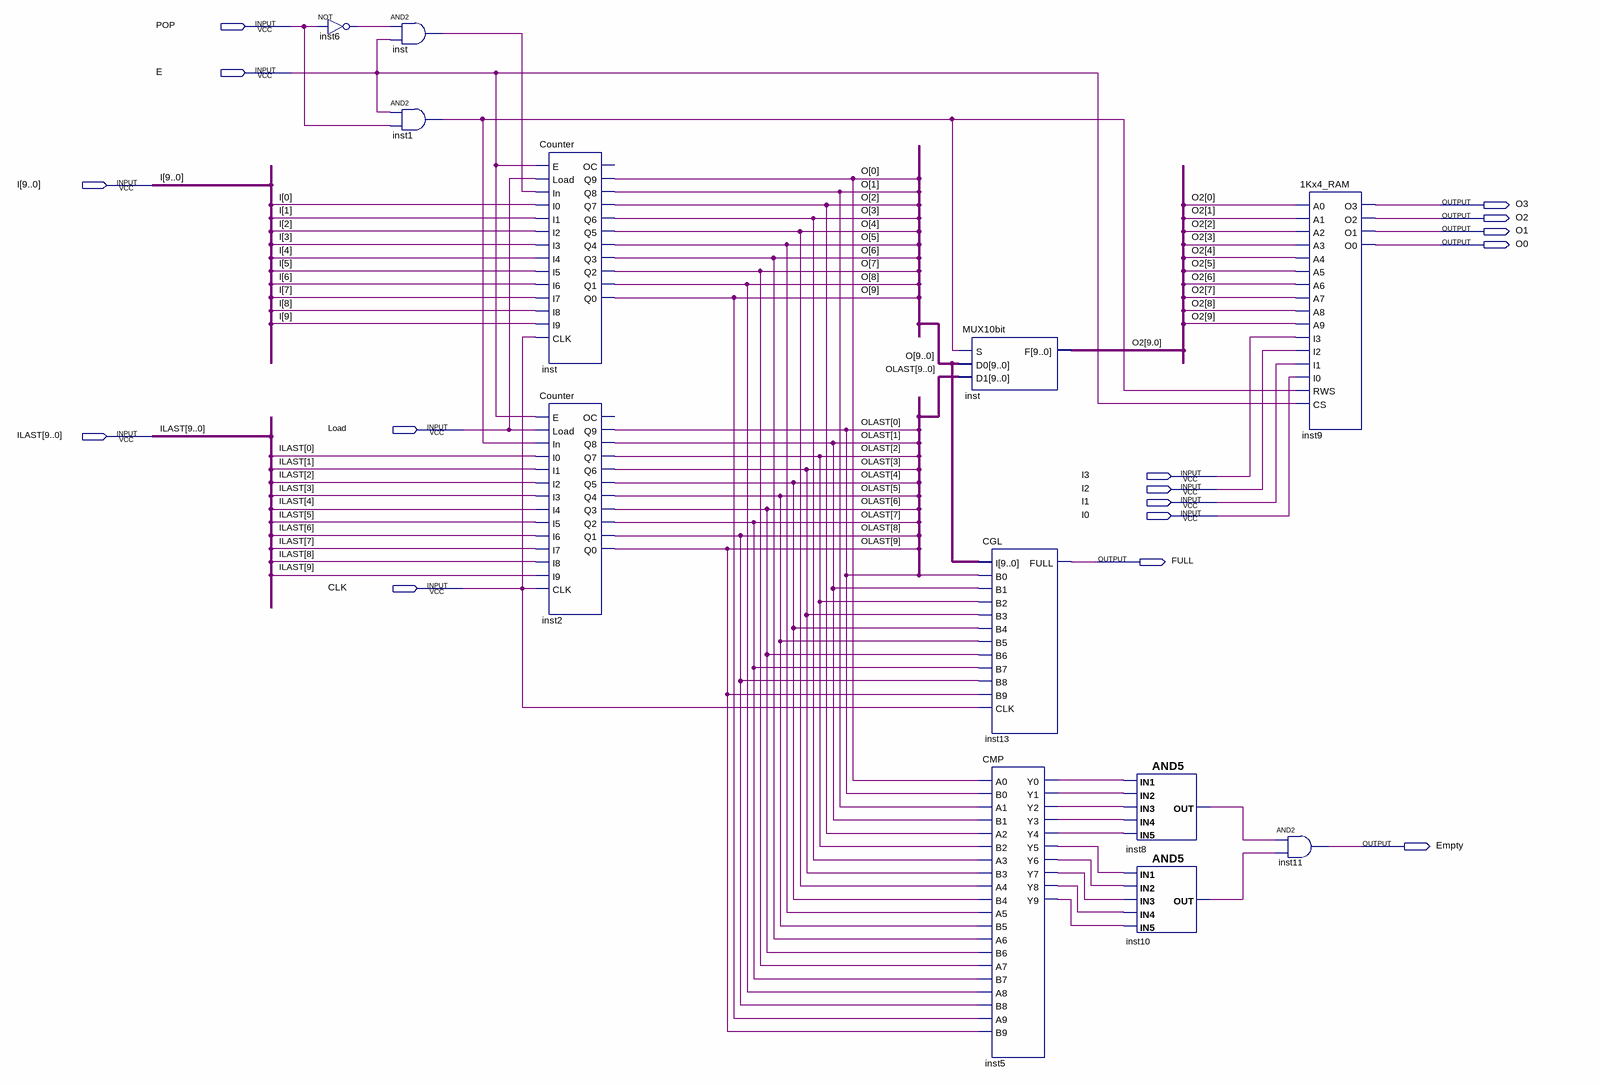
[diagram p0: schematic sheet]
// Quartus schematic STACK.bdf as structural Verilog: 12 symbols, 16 pins
module STACK (
  input  POP,
  input  E,
  input  [9:0] I,
  input  Load,
  input  [9:0] ILAST,
  input  I3,
  input  I2,
  input  I1,
  input  I0,
  input  CLK,
  output O3,
  output O2,
  output O1,
  output O0,
  output FULL,
  output Empty
);

  wire inst1_out, inst5_y0, inst5_y1, inst5_y2, inst5_y3, inst5_y4, inst5_y5, inst5_y6, inst5_y7, inst5_y8,
       inst5_y9, inst6_out, inst8_out, inst10_out, inst_out, \O2[9.0] ;
  wire [9:0] O2_bus, OLAST;
  wire [9:4] O;

  not inst6 (inst6_out, POP);
  and inst (inst_out, inst6_out, E);
  and inst1 (inst1_out, E, POP);
  Counter inst_dup2 (
    .E(E), .Load(Load), .In(inst_out), .I0(I[0]), .I1(I[1]), .I2(I[2]), .I3(I[3]), .I4(I[4]), .I5(I[5]),
    .I6(I[6]), .I7(I[7]), .I8(I[8]), .I9(I[9]), .CLK(CLK), .Q9(O0), .Q8(O1), .Q7(O2), .Q6(O3), .Q5(O[4]),
    .Q4(O[5]), .Q3(O[6]), .Q2(O[7]), .Q1(O[8]), .Q0(O[9]));  // open: OC
  Counter inst2 (
    .E(E), .Load(Load), .In(inst1_out), .I0(ILAST[0]), .I1(ILAST[1]), .I2(ILAST[2]), .I3(ILAST[3]),
    .I4(ILAST[4]), .I5(ILAST[5]), .I6(ILAST[6]), .I7(ILAST[7]), .I8(ILAST[8]), .I9(ILAST[9]), .CLK(CLK),
    .Q9(OLAST[0]), .Q8(OLAST[1]), .Q7(OLAST[2]), .Q6(OLAST[3]), .Q5(OLAST[4]), .Q4(OLAST[5]), .Q3(OLAST[6]),
    .Q2(OLAST[7]), .Q1(OLAST[8]), .Q0(OLAST[9]));  // open: OC
  MUX10bit inst_dup3 (.S(inst1_out), .D0({O, O3, O2, O1, O0}), .D1(OLAST), .F(\O2[9.0] ));
  CGL inst13 (
    .I({O, O3, O2, O1, O0}), .B0(OLAST[0]), .B1(OLAST[1]), .B2(OLAST[2]), .B3(OLAST[3]), .B4(OLAST[4]),
    .B5(OLAST[5]), .B6(OLAST[6]), .B7(OLAST[7]), .B8(OLAST[8]), .B9(OLAST[9]), .CLK(CLK), .FULL(FULL));
  CMP inst5 (
    .A0(O0), .B0(OLAST[0]), .A1(O1), .B1(OLAST[1]), .A2(O2), .B2(OLAST[2]), .A3(O3), .B3(OLAST[3]),
    .A4(O[4]), .B4(OLAST[4]), .A5(O[5]), .B5(OLAST[5]), .A6(O[6]), .B6(OLAST[6]), .A7(O[7]), .B7(OLAST[7]),
    .A8(O[8]), .B8(OLAST[8]), .A9(O[9]), .B9(OLAST[9]), .Y0(inst5_y0), .Y1(inst5_y1), .Y2(inst5_y2),
    .Y3(inst5_y3), .Y4(inst5_y4), .Y5(inst5_y5), .Y6(inst5_y6), .Y7(inst5_y7), .Y8(inst5_y8), .Y9(inst5_y9));
  and inst8 (inst8_out, inst5_y0, inst5_y1, inst5_y2, inst5_y3, inst5_y4);
  and inst10 (inst10_out, inst5_y5, inst5_y6, inst5_y7, inst5_y8, inst5_y9);
  \1Kx4_RAM  inst9 (
    .A0(O2_bus[0]), .A1(O2_bus[1]), .A2(O2_bus[2]), .A3(O2_bus[3]), .A4(O2_bus[4]), .A5(O2_bus[5]),
    .A6(O2_bus[6]), .A7(O2_bus[7]), .A8(O2_bus[8]), .A9(O2_bus[9]), .I3(I3), .I2(I2), .I1(I1), .I0(I0),
    .RWS(inst1_out), .CS(E), .O3(O3), .O2(O2), .O1(O1), .O0(O0));
  and inst11 (Empty, inst8_out, inst10_out);
endmodule
